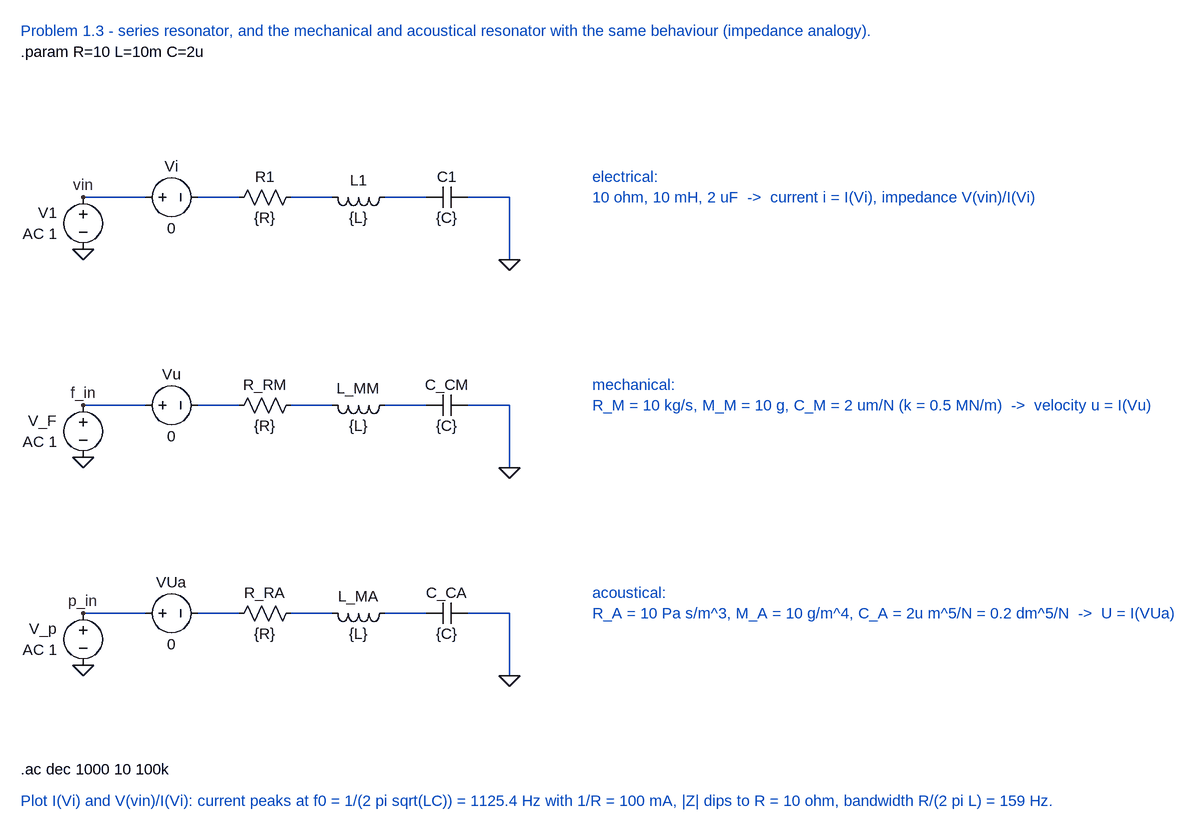
[diagram p0: schematic P1_3_Series_Resonator.asc]
P1_3_Series_Resonator.asc, the LTspice schematic file:
Version 4
SHEET 1 3000 1600
WIRE 0 0 96 0
WIRE 176 0 240 0
WIRE 320 0 384 0
WIRE 464 0 528 0
WIRE 592 0 656 0
WIRE 656 0 656 96
WIRE 0 320 96 320
WIRE 176 320 240 320
WIRE 320 320 384 320
WIRE 464 320 528 320
WIRE 592 320 656 320
WIRE 656 320 656 416
WIRE 0 640 96 640
WIRE 176 640 240 640
WIRE 320 640 384 640
WIRE 464 640 528 640
WIRE 592 640 656 640
WIRE 656 640 656 736
FLAG 0 80 0
FLAG 0 0 vin
FLAG 656 96 0
FLAG 0 400 0
FLAG 0 320 f_in
FLAG 656 416 0
FLAG 0 720 0
FLAG 0 640 p_in
FLAG 656 736 0
SYMBOL voltage 0 -16 R0
WINDOW 0 -40 40 Right 2
WINDOW 3 -40 72 Right 2
SYMATTR InstName V1
SYMATTR Value AC 1
SYMBOL voltage 80 0 R270
WINDOW 0 32 56 VTop 2
WINDOW 3 -32 56 VBottom 2
SYMATTR InstName Vi
SYMATTR Value 0
SYMBOL res 336 -16 R90
WINDOW 0 0 56 VBottom 2
WINDOW 3 32 56 VTop 2
SYMATTR InstName R1
SYMATTR Value {R}
SYMBOL ind 480 -16 R90
WINDOW 0 5 56 VBottom 2
WINDOW 3 32 56 VTop 2
SYMATTR InstName L1
SYMATTR Value {L}
SYMATTR SpiceLine Rser=0
SYMBOL cap 592 -16 R90
WINDOW 0 0 32 VBottom 2
WINDOW 3 32 32 VTop 2
SYMATTR InstName C1
SYMATTR Value {C}
SYMBOL voltage 0 304 R0
WINDOW 0 -40 40 Right 2
WINDOW 3 -40 72 Right 2
SYMATTR InstName V_F
SYMATTR Value AC 1
SYMBOL voltage 80 320 R270
WINDOW 0 32 56 VTop 2
WINDOW 3 -32 56 VBottom 2
SYMATTR InstName Vu
SYMATTR Value 0
SYMBOL res 336 304 R90
WINDOW 0 0 56 VBottom 2
WINDOW 3 32 56 VTop 2
SYMATTR InstName R_RM
SYMATTR Value {R}
SYMBOL ind 480 304 R90
WINDOW 0 5 56 VBottom 2
WINDOW 3 32 56 VTop 2
SYMATTR InstName L_MM
SYMATTR Value {L}
SYMATTR SpiceLine Rser=0
SYMBOL cap 592 304 R90
WINDOW 0 0 32 VBottom 2
WINDOW 3 32 32 VTop 2
SYMATTR InstName C_CM
SYMATTR Value {C}
SYMBOL voltage 0 624 R0
WINDOW 0 -40 40 Right 2
WINDOW 3 -40 72 Right 2
SYMATTR InstName V_p
SYMATTR Value AC 1
SYMBOL voltage 80 640 R270
WINDOW 0 32 56 VTop 2
WINDOW 3 -32 56 VBottom 2
SYMATTR InstName VUa
SYMATTR Value 0
SYMBOL res 336 624 R90
WINDOW 0 0 56 VBottom 2
WINDOW 3 32 56 VTop 2
SYMATTR InstName R_RA
SYMATTR Value {R}
SYMBOL ind 480 624 R90
WINDOW 0 5 56 VBottom 2
WINDOW 3 32 56 VTop 2
SYMATTR InstName L_MA
SYMATTR Value {L}
SYMATTR SpiceLine Rser=0
SYMBOL cap 592 624 R90
WINDOW 0 0 32 VBottom 2
WINDOW 3 32 32 VTop 2
SYMATTR InstName C_CA
SYMATTR Value {C}
TEXT -96 -256 Left 2 ;Problem 1.3 - series resonator, and the mechanical and acoustical resonator with the same behaviour (impedance analogy).
TEXT -96 -224 Left 2 !.param R=10 L=10m C=2u
TEXT 784 -32 Left 2 ;electrical:
TEXT 784 0 Left 2 ;10 ohm, 10 mH, 2 uF  ->  current i = I(Vi), impedance V(vin)/I(Vi)
TEXT 784 288 Left 2 ;mechanical:
TEXT 784 320 Left 2 ;R_M = 10 kg/s, M_M = 10 g, C_M = 2 um/N (k = 0.5 MN/m)  ->  velocity u = I(Vu)
TEXT 784 608 Left 2 ;acoustical:
TEXT 784 640 Left 2 ;R_A = 10 Pa s/m^3, M_A = 10 g/m^4, C_A = 2u m^5/N = 0.2 dm^5/N  ->  U = I(VUa)
TEXT -96 880 Left 2 !.ac dec 1000 10 100k
TEXT -96 928 Left 2 ;Plot I(Vi) and V(vin)/I(Vi): current peaks at f0 = 1/(2 pi sqrt(LC)) = 1125.4 Hz with 1/R = 100 mA, |Z| dips to R = 10 ohm, bandwidth R/(2 pi L) = 159 Hz.

The netlist it stands for:
* P1_3_Series_Resonator.asc
V1 vin 0 AC 1
Vi vin N001 0
R1 N002 N001 {R}
L1 N003 N002 {L} Rser=0
C1 0 N003 {C}
V_F f_in 0 AC 1
Vu f_in N004 0
R_RM N005 N004 {R}
L_MM N006 N005 {L} Rser=0
C_CM 0 N006 {C}
V_p p_in 0 AC 1
VUa p_in N007 0
R_RA N008 N007 {R}
L_MA N009 N008 {L} Rser=0
C_CA 0 N009 {C}
* Problem 1.3 - series resonator, and the mechanical and acoustical resonator with the same behaviour (impedance analogy).
.param R=10 L=10m C=2u
* electrical:
* 10 ohm, 10 mH, 2 uF  ->  current i = I(Vi), impedance V(vin)/I(Vi)
* mechanical:
* R_M = 10 kg/s, M_M = 10 g, C_M = 2 um/N (k = 0.5 MN/m)  ->  velocity u = I(Vu)
* acoustical:
* R_A = 10 Pa s/m^3, M_A = 10 g/m^4, C_A = 2u m^5/N = 0.2 dm^5/N  ->  U = I(VUa)
.ac dec 1000 10 100k
* Plot I(Vi) and V(vin)/I(Vi): current peaks at f0 = 1/(2 pi sqrt(LC)) = 1125.4 Hz with 1/R = 100 mA, |Z| dips to R = 10 ohm, bandwidth R/(2 pi L) = 159 Hz.
.backanno
.end